# EAGLE design keypadv3 (EAGLE 9.4.2)
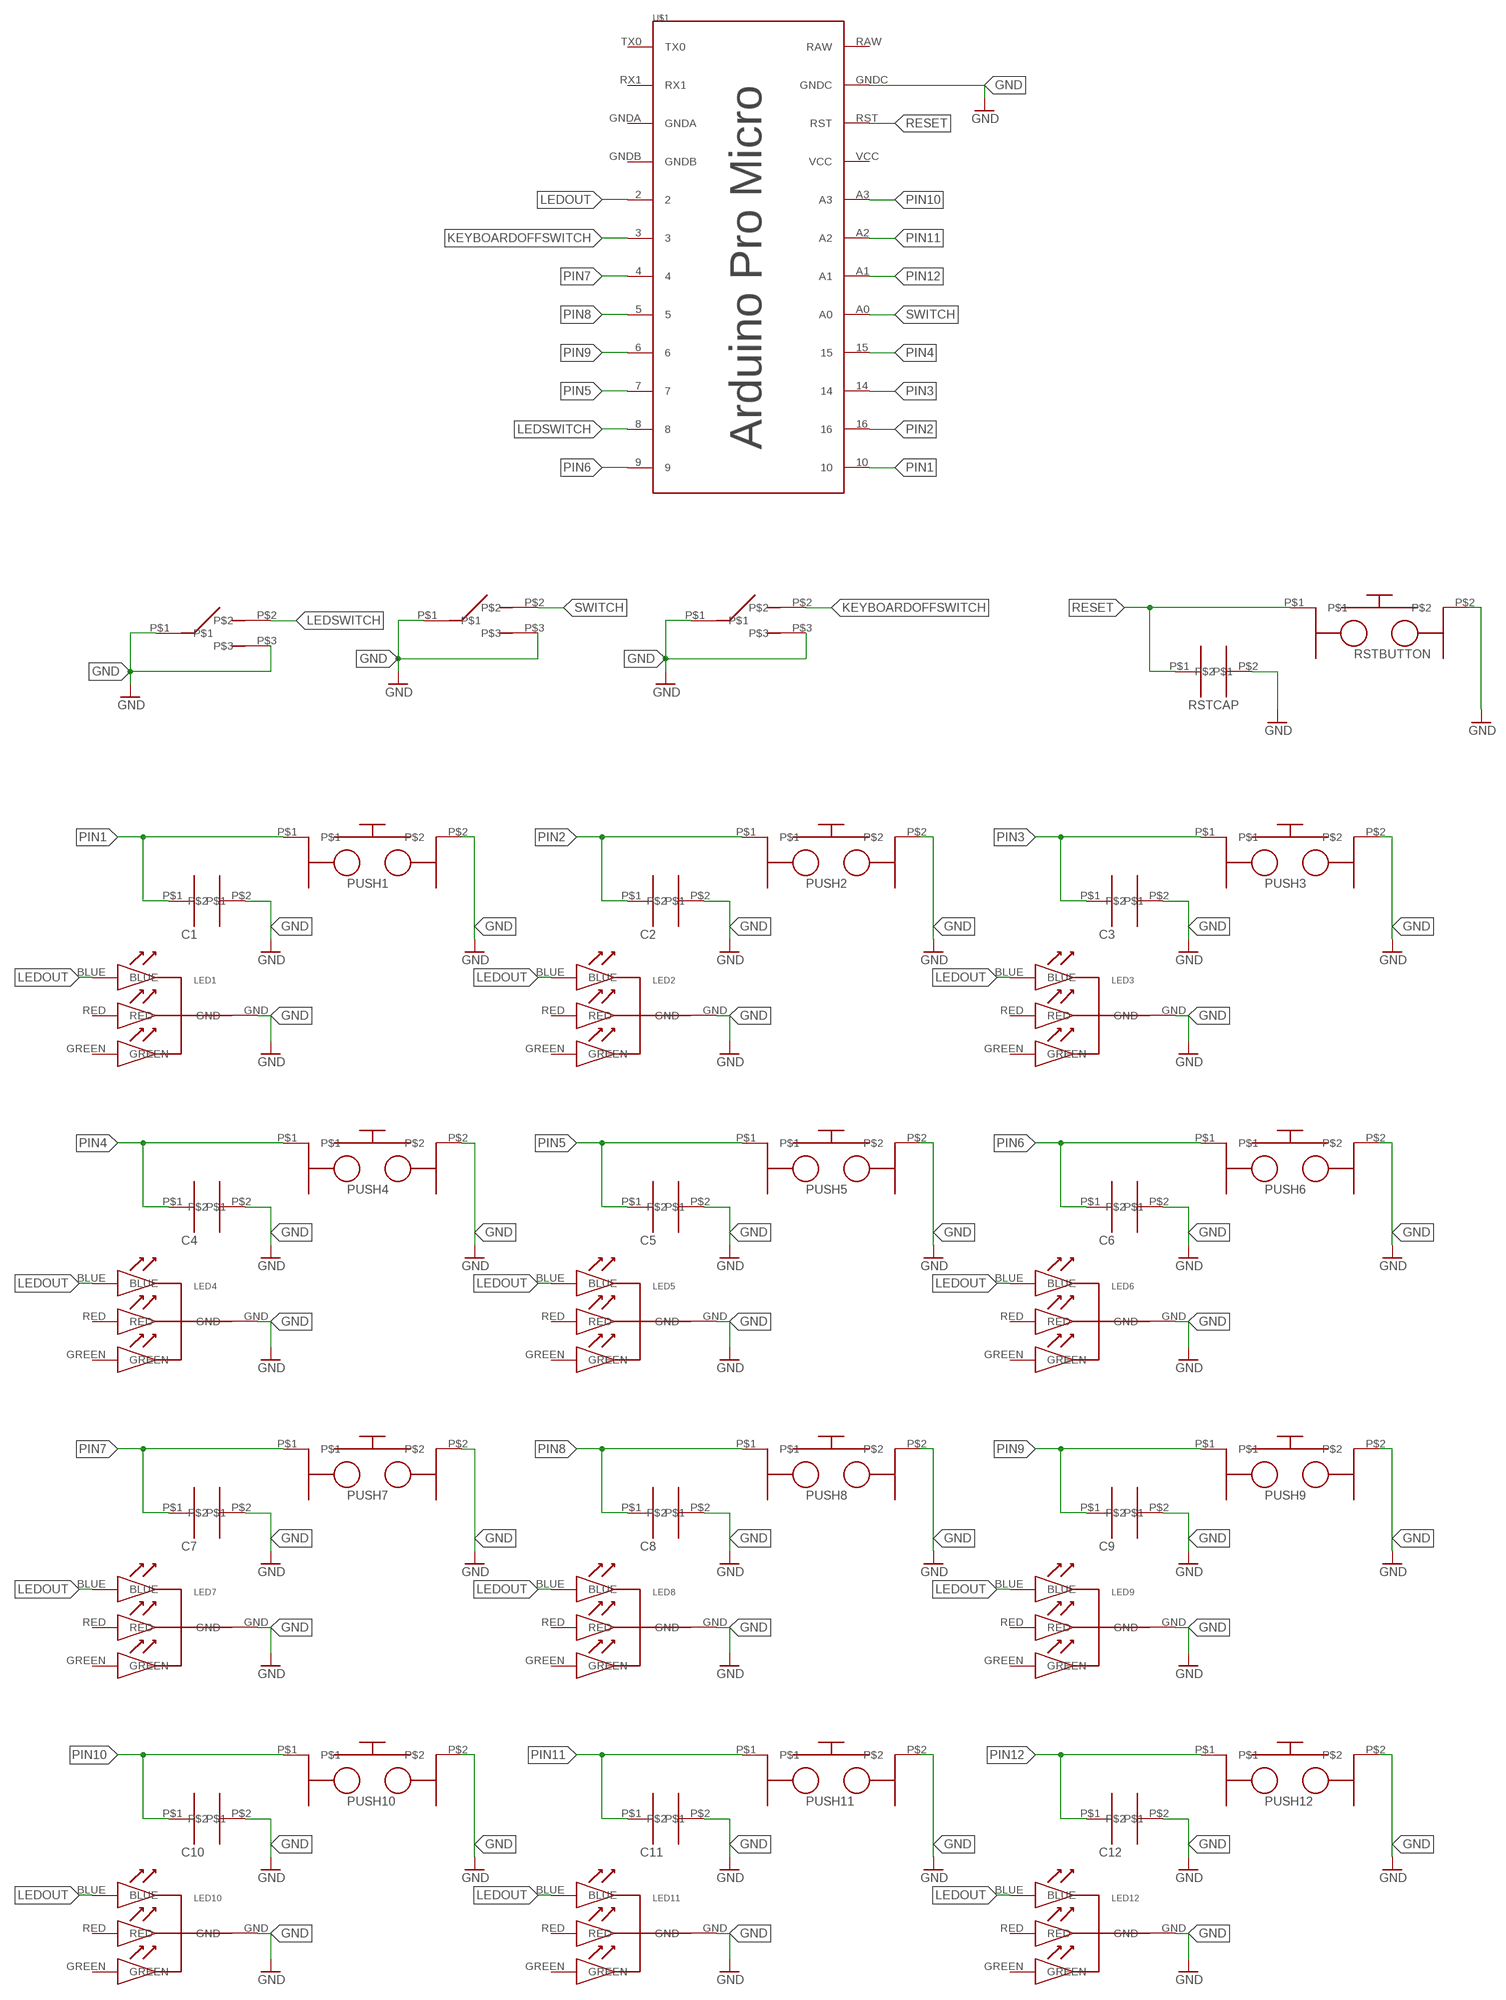
[diagram p0: schematic, sheet 1]

## Parts
C1  CERAMICCAP  [CERAMICCAPACITOR]
C2  CERAMICCAP  [CERAMICCAPACITOR]
C3  CERAMICCAP  [CERAMICCAPACITOR]
C4  CERAMICCAP  [CERAMICCAPACITOR]
C5  CERAMICCAP  [CERAMICCAPACITOR]
C6  CERAMICCAP  [CERAMICCAPACITOR]
C7  CERAMICCAP  [CERAMICCAPACITOR]
C8  CERAMICCAP  [CERAMICCAPACITOR]
C9  CERAMICCAP  [CERAMICCAPACITOR]
C10  CERAMICCAP  [CERAMICCAPACITOR]
C11  CERAMICCAP  [CERAMICCAPACITOR]
C12  CERAMICCAP  [CERAMICCAPACITOR]
LED1  RGBLED5MMCOMMONCATHODE  [LEADSPREAD]
LED2  RGBLED5MMCOMMONCATHODE  [LEADSPREAD]
LED3  RGBLED5MMCOMMONCATHODE  [LEADSPREAD]
LED4  RGBLED5MMCOMMONCATHODE  [LEADSPREAD]
LED5  RGBLED5MMCOMMONCATHODE  [LEADSPREAD]
LED6  RGBLED5MMCOMMONCATHODE  [LEADSPREAD]
LED7  RGBLED5MMCOMMONCATHODE  [LEADSPREAD]
LED8  RGBLED5MMCOMMONCATHODE  [LEADSPREAD]
LED9  RGBLED5MMCOMMONCATHODE  [LEADSPREAD]
LED10  RGBLED5MMCOMMONCATHODE  [LEADSPREAD]
LED11  RGBLED5MMCOMMONCATHODE  [LEADSPREAD]
LED12  RGBLED5MMCOMMONCATHODE  [LEADSPREAD]
PUSH1  2LEADS  [2LEADS]
PUSH2  2LEADS  [2LEADS]
PUSH3  2LEADS  [2LEADS]
PUSH4  2LEADS  [2LEADS]
PUSH5  2LEADS  [2LEADS]
PUSH6  2LEADS  [2LEADS]
PUSH7  2LEADS  [2LEADS]
PUSH8  2LEADS  [2LEADS]
PUSH9  2LEADS  [2LEADS]
PUSH10  2LEADS  [2LEADS]
PUSH11  2LEADS  [2LEADS]
PUSH12  2LEADS  [2LEADS]
RSTBUTTON  2LEADS  [2LEADS]
RSTCAP  CERAMICCAP  [CERAMICCAPACITOR]
SWITCH1  SWITCH  [THREEPINSWITCH]
SWITCH2  SWITCH  [THREEPINSWITCH]
SWITCH3  SWITCH  [THREEPINSWITCH]
U$1  ARDUINOPROMICRO  [ARDUINO_PRO_MICRO]

## Nets
GND: C1.P$2 C2.P$2 C3.P$2 C4.P$2 C5.P$2 C6.P$2 C7.P$2 C8.P$2 C9.P$2 C10.P$2 C11.P$2 C12.P$2 LED1.GND LED2.GND LED3.GND LED4.GND LED5.GND LED6.GND LED7.GND LED8.GND LED9.GND LED10.GND LED11.GND LED12.GND PUSH1.P$2 PUSH2.P$2 PUSH3.P$2 PUSH4.P$2 PUSH5.P$2 PUSH6.P$2 PUSH7.P$2 PUSH8.P$2 PUSH9.P$2 PUSH10.P$2 PUSH11.P$2 PUSH12.P$2 RSTBUTTON.P$2 RSTCAP.P$2 SWITCH1.P$1 SWITCH1.P$3 SWITCH2.P$1 SWITCH2.P$3 SWITCH3.P$1 SWITCH3.P$3 U$1.GNDC
KEYBOARDOFFSWITCH: SWITCH2.P$2 U$1.3
LEDOUT: LED1.BLUE LED2.BLUE LED3.BLUE LED4.BLUE LED5.BLUE LED6.BLUE LED7.BLUE LED8.BLUE LED9.BLUE LED10.BLUE LED11.BLUE LED12.BLUE U$1.2
LEDSWITCH: SWITCH1.P$2 U$1.8
PIN1: C1.P$1 PUSH1.P$1 U$1.10
PIN2: C2.P$1 PUSH2.P$1 U$1.16
PIN3: C3.P$1 PUSH3.P$1 U$1.14
PIN4: C4.P$1 PUSH4.P$1 U$1.15
PIN5: C5.P$1 PUSH5.P$1 U$1.7
PIN6: C6.P$1 PUSH6.P$1 U$1.9
PIN7: C7.P$1 PUSH7.P$1 U$1.4
PIN8: C8.P$1 PUSH8.P$1 U$1.5
PIN9: C9.P$1 PUSH9.P$1 U$1.6
PIN10: C10.P$1 PUSH10.P$1 U$1.A3
PIN11: C11.P$1 PUSH11.P$1 U$1.A2
PIN12: C12.P$1 PUSH12.P$1 U$1.A1
RESET: RSTBUTTON.P$1 RSTCAP.P$1 U$1.RST
SWITCH: SWITCH3.P$2 U$1.A0
Unconnected: LED1.GREEN LED1.RED LED2.GREEN LED2.RED LED3.GREEN LED3.RED LED4.GREEN LED4.RED LED5.GREEN LED5.RED LED6.GREEN LED6.RED LED7.GREEN LED7.RED LED8.GREEN LED8.RED LED9.GREEN LED9.RED LED10.GREEN LED10.RED LED11.GREEN LED11.RED LED12.GREEN LED12.RED U$1.GNDA U$1.GNDB U$1.RAW U$1.RX1 U$1.TX0 U$1.VCC

## Library data of the parts
C1-C12 RSTCAP = capacitors:CERAMICCAP
LED1-LED12 = customLEDS:RGBLED5MMCOMMONCATHODE
PUSH1-PUSH12 RSTBUTTON = pushbutton:2LEADS
SWITCH1-SWITCH3 = Switch:SWITCH
U$1 = arduino_pro_micro:ARDUINOPROMICRO

## Board
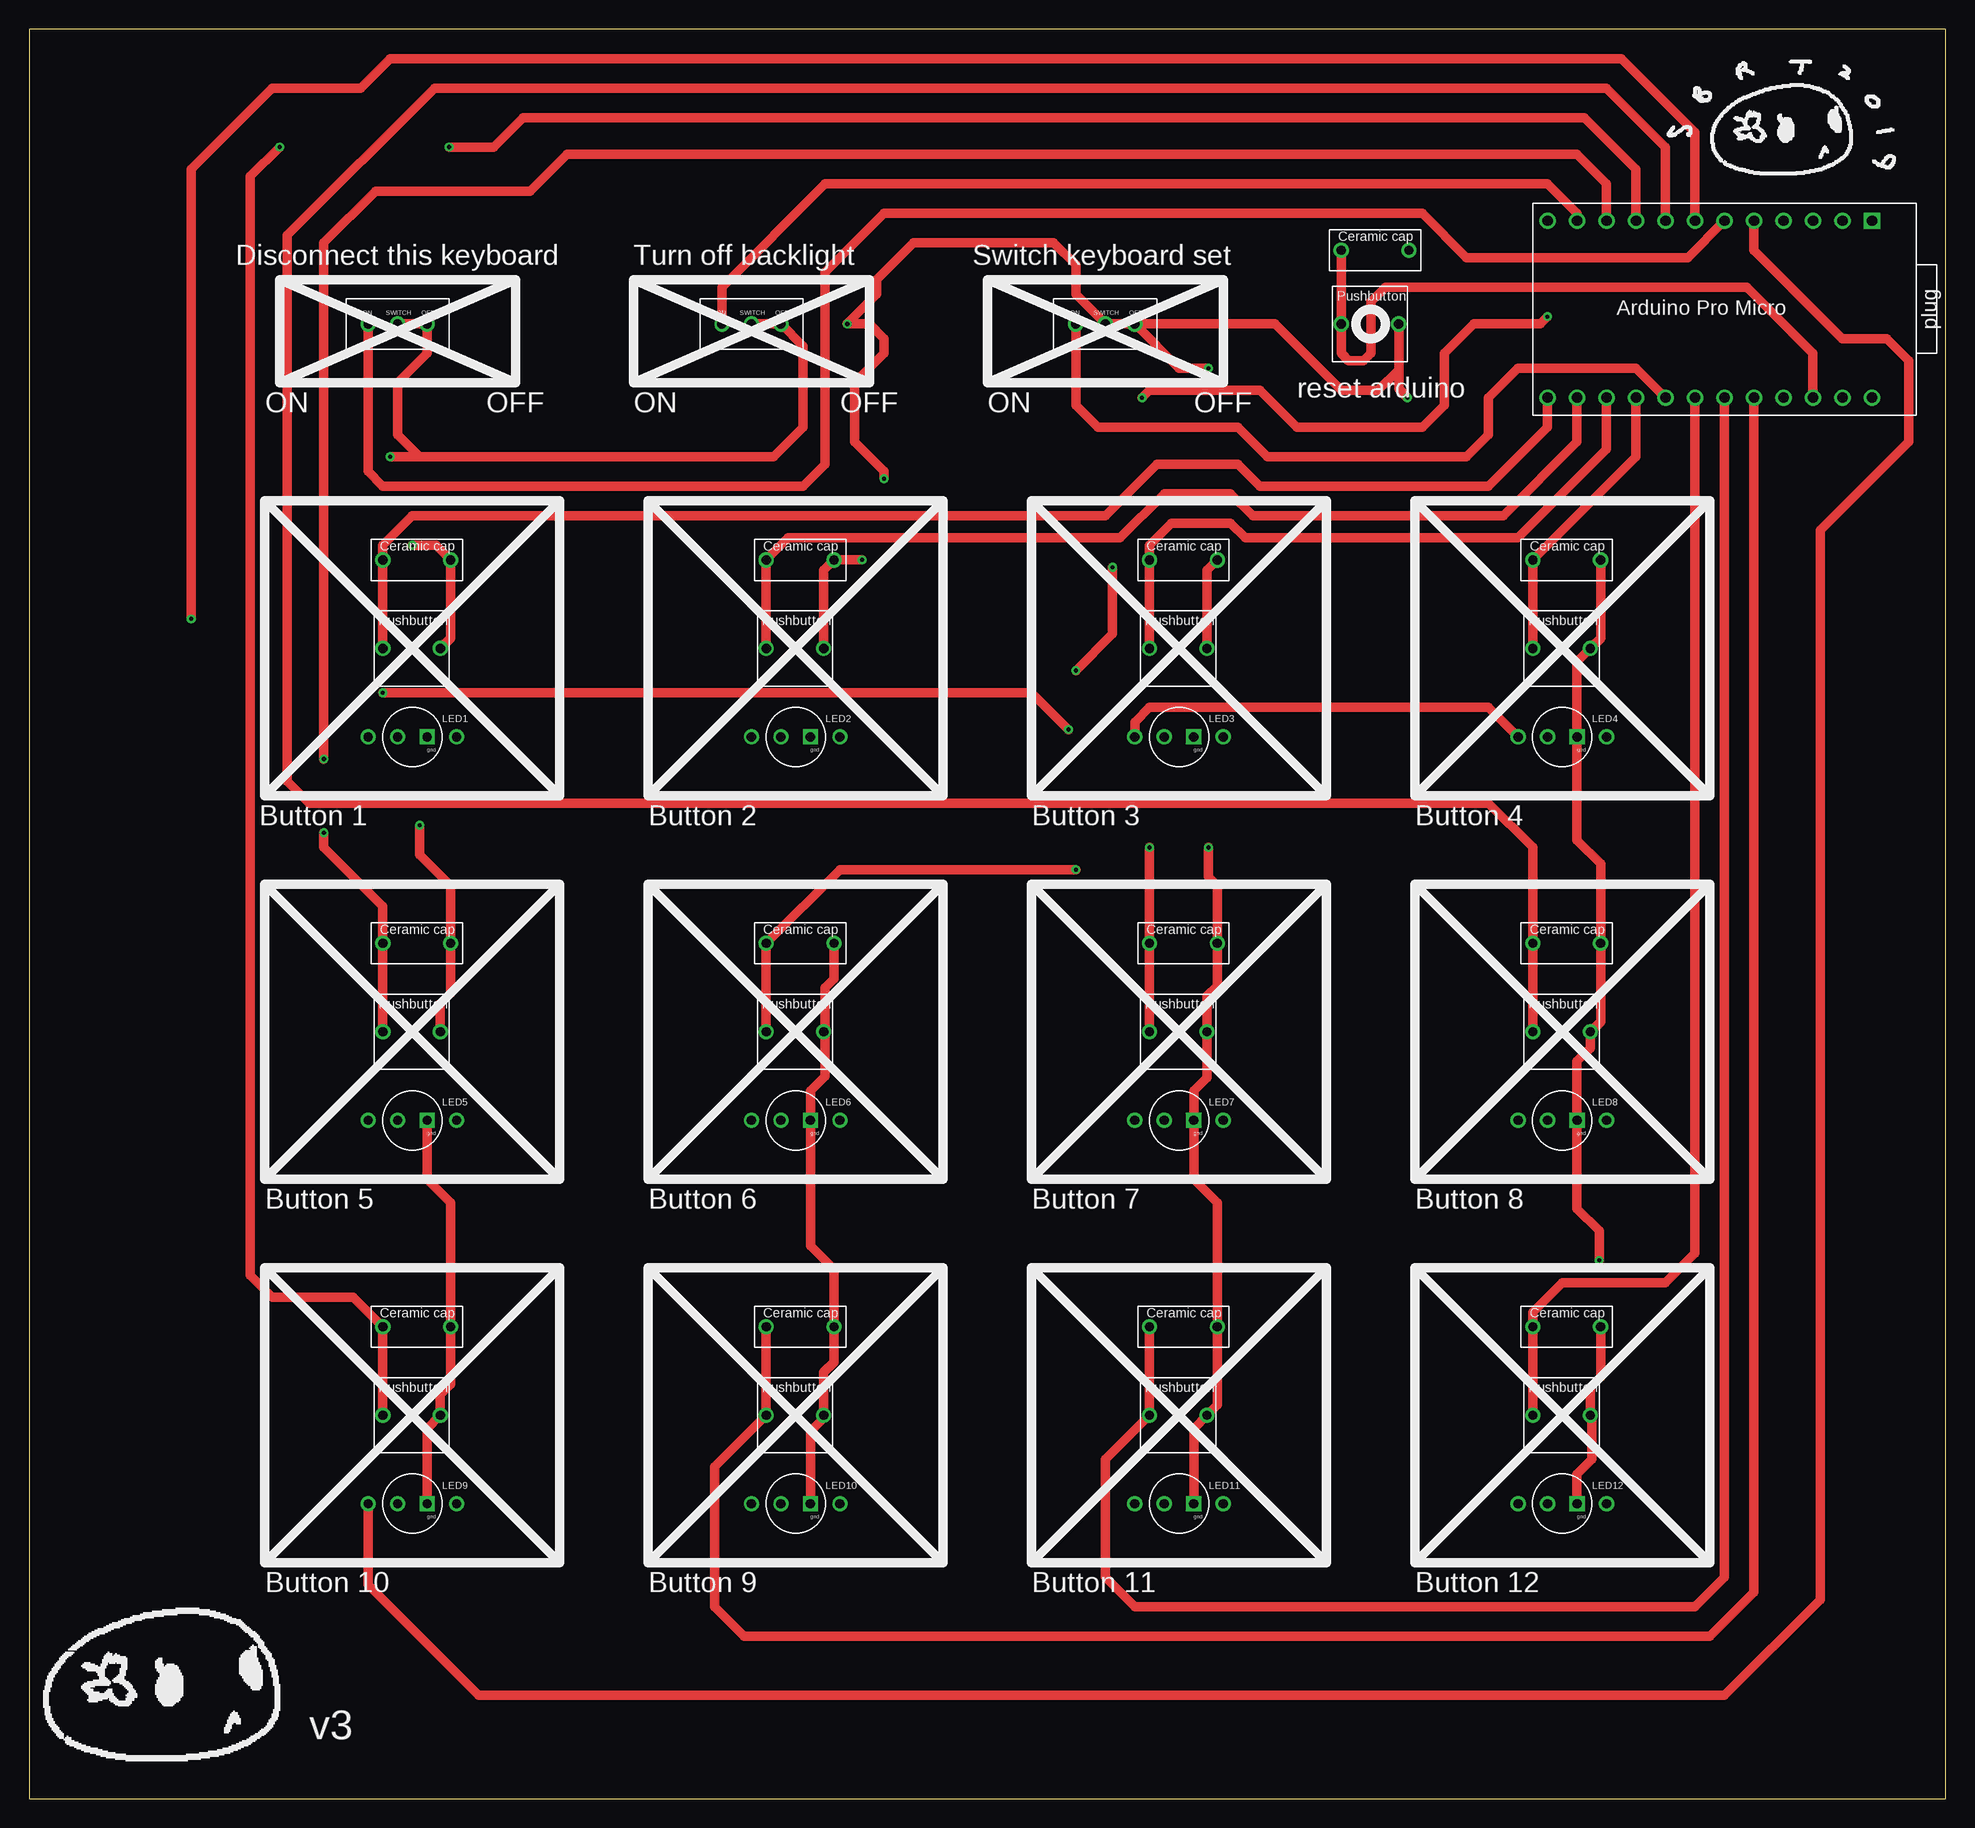
[diagram p1: board, top side]
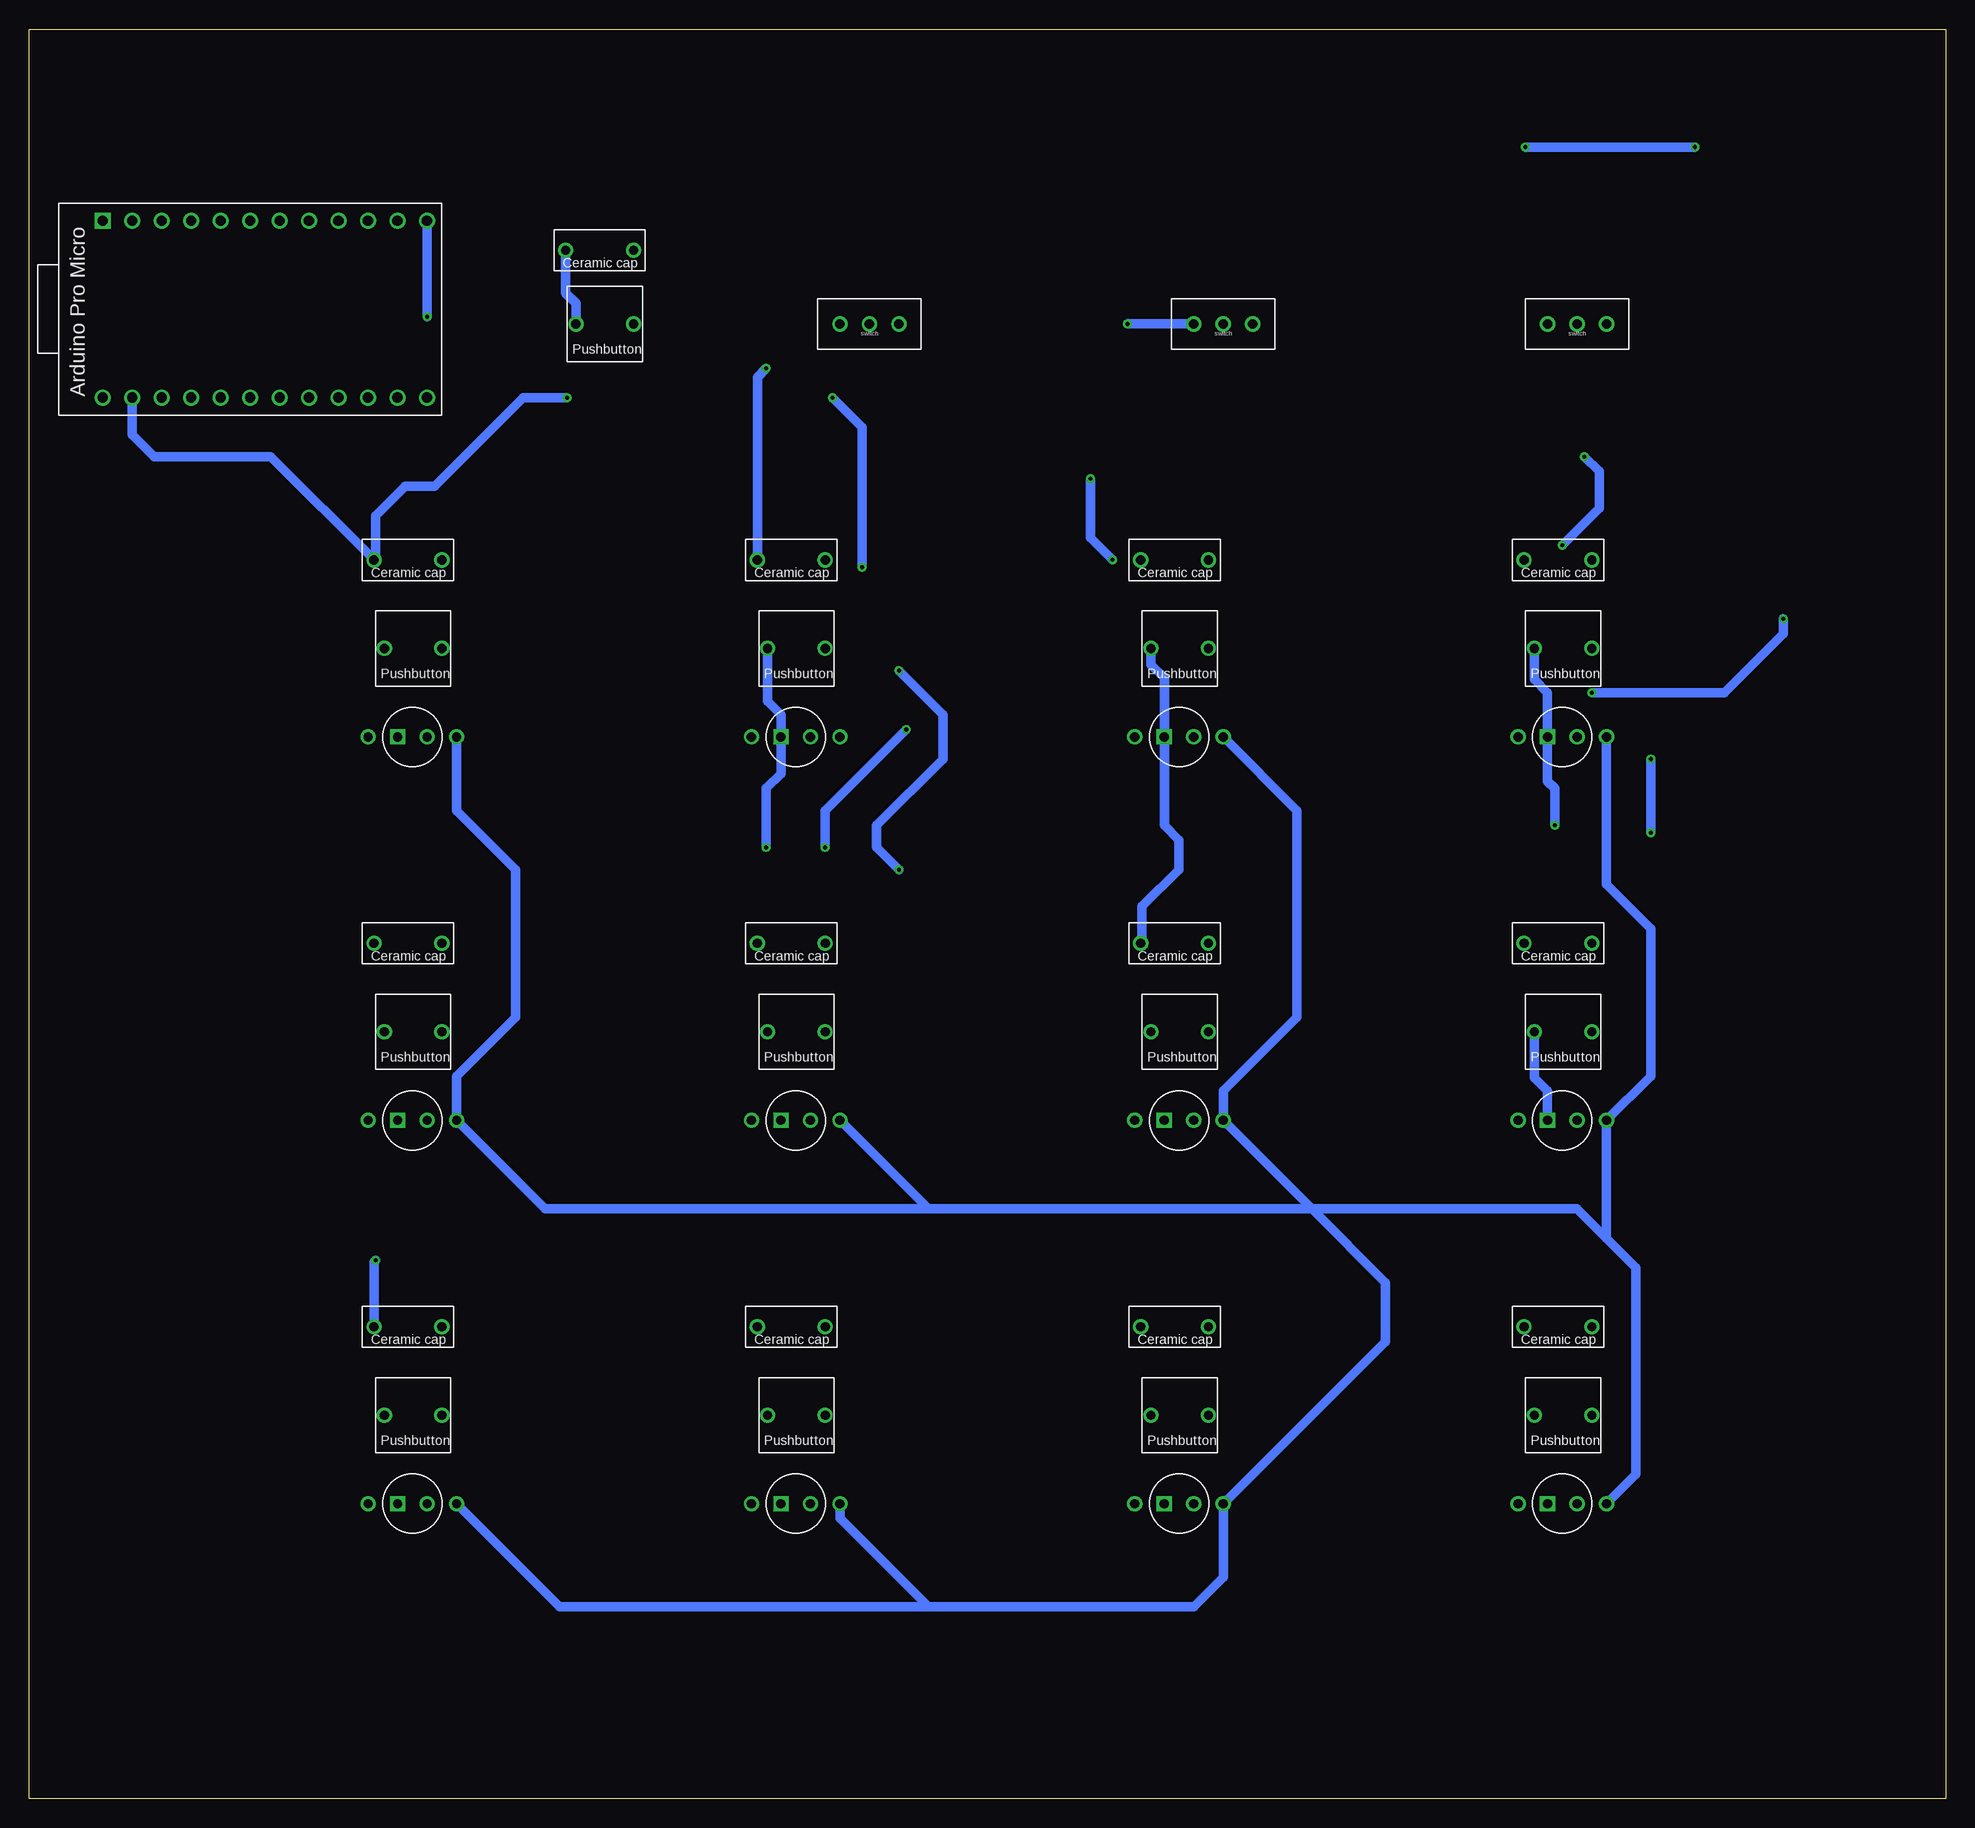
[diagram p2: board, bottom side, seen from below]

Size 165.1 x 152.4 mm. Coordinates in mm from the lower left corner, seen from the top.
Outline: 0,0 165.1,0 165.1,152.4 0,152.4 0,0
Copper layers (1*16): Top 0.035mm / dielectric 1.5mm / Bottom 0.035mm
Design rules "default": minimum track width 6mil, minimum drill 0.35mm, track to track 6mil, track to pad 6mil, pad to pad 6mil, via to via 6mil, smd to smd 6mil, copper to edge 40mil, drill to drill 6mil, minimum pad ring 10mil, minimum via ring 8mil, stop-mask expansion 4mil, vias tented up to drill 0mil, thermal gap 10mil

### Footprints (pad centres in the part's own frame; a part is rotated, then mirrored left to right if it is on the bottom)
CERAMICCAPACITOR = drill 0.8: P$1 0,0; P$2 5.842,0
LEADSPREAD = drill 0.8: BLUE -3.81,0; GREEN -1.27,0; RED 3.81,0 | drill 0.8 square: GND 1.27,0
2LEADS = drill 0.8: P$1 0,0; P$2 4.953,0
THREEPINSWITCH = drill 0.8: P$1 2.54,0; P$2 0,0; P$3 5.08,0
ARDUINO_PRO_MICRO = drill 0.9: 2 0,-10.16; 3 0,-12.7; 4 0,-15.24; 5 0,-17.78; 6 0,-20.32; 7 0,-22.86; 8 0,-25.4; 9 0,-27.94; 10 15.24,-27.94; 14 15.24,-22.86; 15 15.24,-20.32; 16 15.24,-25.4; A0 15.24,-17.78; A1 15.24,-15.24; A2 15.24,-12.7; A3 15.24,-10.16; GNDA 0,-5.08; GNDB 0,-7.62; GNDC 15.24,-2.54; RAW 15.24,0; RST 15.24,-5.08; RX1 0,-2.54; VCC 15.24,-7.62 | drill 0.9 square: TX0 0,0

### Placement (x,y rotation side)
C1  30.48,106.68 0 top
C2  63.5,106.68 0 top
C3  96.52,106.68 0 top
C4  129.54,106.68 0 top
C5  30.48,73.66 0 top
C6  63.5,73.66 0 top
C7  96.52,73.66 0 top
C8  129.54,73.66 0 top
C9  30.48,40.64 0 top
C10  63.5,40.64 0 top
C11  96.52,40.64 0 top
C12  129.54,40.64 0 top
LED1  33.02,91.44 0 top
LED2  66.04,91.44 0 top
LED3  99.06,91.44 0 top
LED4  132.08,91.44 0 top
LED5  33.02,58.42 0 top
LED6  66.04,58.42 0 top
LED7  99.06,58.42 0 top
LED8  132.08,58.42 0 top
LED9  33.02,25.4 0 top
LED10  66.04,25.4 0 top
LED11  99.06,25.4 0 top
LED12  132.08,25.4 0 top
PUSH1  30.48,99.06 0 top
PUSH2  63.5,99.06 0 top
PUSH3  96.52,99.06 0 top
PUSH4  129.54,99.06 0 top
PUSH5  30.48,66.04 0 top
PUSH6  63.5,66.04 0 top
PUSH7  96.52,66.04 0 top
PUSH8  129.54,66.04 0 top
PUSH9  30.48,33.02 0 top
PUSH10  63.5,33.02 0 top
PUSH11  96.52,33.02 0 top
PUSH12  129.54,33.02 0 top
RSTBUTTON  113.03,127 0 top
RSTCAP  113.03,133.35 0 top
SWITCH1  59.69,127 0 top
SWITCH2  29.21,127 0 top
SWITCH3  90.17,127 0 top
U$1  158.75,135.89 270 top

### Tracks (layer width: path | path; a pad name or v marks a point on that pad's centre or on a via)
GND  (via drill 0.35)
  Top 0.813: SWITCH2.P$1 SWITCH2.P$3 34.29,124.46 31.75,121.92 31.75,117.47 33.66,115.57 | SWITCH1.P$1 SWITCH1.P$3 66.67,125.09 66.67,118.11 64.14,115.57 33.66,115.57 | SWITCH3.P$3 SWITCH3.P$1 90.17,129.54 90.17,132.08 88.27,133.99 76.2,133.99 73.03,130.81 73.03,129.54 v70.48,127 72.39,127 73.66,125.73 73.66,124.46 71.12,121.92 71.12,116.84 73.66,114.3 v73.66,113.67 | SWITCH3.P$3 107.31,127 113.03,121.28 116.2,121.28 117.98,123.06 | RSTBUTTON.P$2 117.98,123.06 | 33.66,115.57 v31.11,115.57 | v33.02,107.95 35.05,107.95 C1.P$2 36.32,99.95 PUSH1.P$2 | v71.75,106.68 C2.P$2 68.45,105.79 PUSH2.P$2 | v101.6,123.19 99.06,123.19 SWITCH3.P$3 | C3.P$2 101.47,105.79 PUSH3.P$2 | v33.66,83.82 33.66,81.28 36.32,78.61 C5.P$2 36.32,69.34 35.43,68.45 PUSH5.P$2 | C6.P$2 69.34,70.61 68.58,69.85 68.58,66.17 | PUSH6.P$2 68.58,66.17 | v101.6,81.92 101.6,79.38 102.36,78.61 C7.P$2 102.36,69.98 101.47,69.09 PUSH7.P$2 101.47,62.1 100.33,60.96 LED7.GND 100.33,53.34 102.36,51.31 C11.P$2 102.36,33.91 PUSH11.P$2 100.33,31.88 LED11.GND | C12.P$2 135.38,36.32 134.49,35.43 PUSH12.P$2 134.62,32.89 134.62,29.21 133.35,27.94 LED12.GND | v135.25,46.35 135.25,48.9 133.35,50.8 LED8.GND 133.35,63.5 134.49,64.64 PUSH8.P$2 135.38,66.93 C8.P$2 135.38,80.52 133.35,82.55 LED4.GND 133.35,97.92 PUSH4.P$2 135.38,99.95 C4.P$2 | 117.98,123.06 117.98,121.41 v118.75,120.65 | LED5.GND 34.29,53.34 36.32,51.31 C9.P$2 36.32,35.69 35.43,34.8 PUSH9.P$2 34.29,31.88 LED9.GND | 68.58,66.17 68.58,62.23 67.31,60.96 LED6.GND 67.31,47.62 69.34,45.59 C10.P$2 69.34,37.59 68.45,36.7 PUSH10.P$2 68.58,32.89 67.31,31.62 LED10.GND
  Bottom 0.813: RSTCAP.P$2 118.87,129.67 117.98,128.78 RSTBUTTON.P$2 | SWITCH1.P$3 v70.48,127 | v31.11,115.57 29.84,114.3 29.84,111.12 v33.02,107.95 | v71.75,106.68 73.66,108.58 v73.66,113.67 | C3.P$2 102.36,122.43 v101.6,123.19 | C6.P$2 69.22,73.79 69.22,76.83 66.04,80.01 66.04,82.55 67.31,83.82 LED2.GND 67.31,96.52 68.45,97.66 PUSH2.P$2 | PUSH3.P$2 101.47,94.49 100.33,93.34 LED3.GND 100.33,88.27 101.6,87 v101.6,81.92 | C12.P$2 135.38,46.23 v135.25,46.35 | U$1.GNDC 156.21,117.47 154.31,115.57 144.27,115.57 C4.P$2 135.25,106.81 135.25,110.49 132.72,113.03 130.18,113.03 122.56,120.65 v118.75,120.65 | PUSH1.P$2 35.43,96.39 34.29,95.25 LED1.GND 34.29,87.63 33.66,87 v33.66,83.82 | LED5.GND 34.29,60.96 35.43,62.1 PUSH5.P$2
KEYBOARDOFFSWITCH
  Top 0.813: U$1.3 142.88,132.72 123.83,132.72 120.02,136.53 73.66,136.53 68.58,131.44 68.58,114.94 66.67,113.03 30.48,113.03 29.21,114.3 SWITCH2.P$2
LEDOUT
  Top 0.813: U$1.2 148.59,133.35 156.21,125.73 160.02,125.73 161.93,123.83 161.93,116.84 154.31,109.22 154.31,17.14 146.05,8.89 38.73,8.89 29.21,18.41 LED9.BLUE | LED3.BLUE 95.25,92.71 96.52,93.98 125.73,93.98 LED4.BLUE
  Bottom 0.813: LED1.BLUE 29.21,78.74 25.4,74.93 25.4,62.23 LED5.BLUE 29.21,48.26 | 29.21,48.26 26.67,45.72 26.67,27.94 LED9.BLUE | 29.21,48.26 31.75,50.8 54.61,50.8 | 54.61,50.8 LED6.BLUE 62.23,60.96 55.88,67.31 55.88,85.09 LED2.BLUE | 54.61,50.8 48.26,44.45 48.26,39.37 LED10.BLUE 62.23,19.05 64.77,16.51 87.63,16.51 | 54.61,50.8 87.63,50.8 | LED7.BLUE 87.63,50.8 | 87.63,16.51 95.25,24.13 LED11.BLUE | 87.63,16.51 119.38,16.51 LED12.BLUE | 87.63,50.8 120.65,50.8 LED8.BLUE 128.27,62.23 123.19,67.31 123.19,80.01 128.27,85.09 LED4.BLUE
LEDSWITCH
  Top 0.813: U$1.8 133.35,136.53 130.81,139.06 68.58,139.06 59.69,130.18 SWITCH1.P$2
PIN1
  Top 0.813: PUSH1.P$1 C1.P$1 30.48,107.95 33.02,110.49 92.71,110.49 97.16,114.94 104.14,114.94 106.05,113.03 125.73,113.03 130.81,118.11 U$1.10
PIN2
  Top 0.813: PUSH2.P$1 C2.P$1 65.41,108.58 93.98,108.58 97.79,112.39 103.5,112.39 105.41,110.49 127,110.49 133.35,116.84 U$1.16
PIN3
  Top 0.813: PUSH3.P$1 C3.P$1 96.52,107.95 98.42,109.86 103.5,109.86 104.78,108.58 128.27,108.58 135.89,116.2 U$1.14
PIN4
  Top 0.813: PUSH4.P$1 C4.P$1 138.43,115.57 U$1.15
PIN5  (via drill 0.35)
  Top 0.813: PUSH5.P$1 C5.P$1 30.48,76.83 25.4,81.92 v25.4,83.19 | U$1.7 135.89,139.06 133.35,141.6 46.35,141.6 43.18,138.43 29.84,138.43 25.4,133.99 v25.4,89.53
  Bottom 0.813: v25.4,89.53 v25.4,83.19
PIN6  (via drill 0.35)
  Top 0.813: PUSH6.P$1 C6.P$1 69.85,80.01 v90.17,80.01 | v95.89,120.65 96.52,121.28 106.05,121.28 109.22,118.11 120.02,118.11 121.92,120.02 121.92,124.46 124.46,127 130.18,127 v130.81,127.64 | v90.17,97.16 93.34,100.33 v93.34,106.05
  Bottom 0.813: v90.17,80.01 92.08,81.92 92.08,83.82 86.36,89.53 86.36,93.34 v90.17,97.16 | v93.34,106.05 93.34,118.11 v95.89,120.65 | v130.81,127.64 U$1.9
PIN7  (via drill 0.35)
  Top 0.813: PUSH7.P$1 C7.P$1 v96.52,81.92 | U$1.4 143.51,143.51 137.16,149.86 31.11,149.86 28.57,147.32 20.95,147.32 13.97,140.34 v13.97,101.6 | v30.48,95.25 86.36,95.25 v89.53,92.08
  Bottom 0.813: v89.53,92.08 96.52,85.09 v96.52,81.92 | v30.48,95.25 19.05,95.25 13.97,100.33 v13.97,101.6
PIN8
  Top 0.813: PUSH8.P$1 C8.P$1 129.54,81.92 125.73,85.72 24.13,85.72 22.23,87.63 22.23,134.62 34.92,147.32 135.89,147.32 140.97,142.24 U$1.5
PIN9  (via drill 0.35)
  Top 0.813: PUSH9.P$1 C9.P$1 27.94,43.18 20.95,43.18 19.05,45.09 19.05,139.7 v21.59,142.24 | v36.2,142.24 40.01,142.24 42.55,144.78 133.99,144.78 138.43,140.34 U$1.6
  Bottom 0.813: v36.2,142.24 v21.59,142.24
PIN10
  Top 0.813: C10.P$1 PUSH10.P$1 59.05,28.57 59.05,16.51 61.59,13.97 144.78,13.97 148.59,17.78 U$1.A3
PIN11
  Top 0.813: C11.P$1 PUSH11.P$1 92.71,29.21 92.71,19.05 95.25,16.51 143.51,16.51 146.05,19.05 U$1.A2
PIN12
  Top 0.813: PUSH12.P$1 C12.P$1 129.54,41.91 132.08,44.45 140.97,44.45 143.51,46.99 U$1.A1
RESET
  Top 0.813: RSTCAP.P$1 RSTBUTTON.P$1 113.03,124.46 113.67,123.83 114.94,123.83 115.57,124.46 115.57,128.91 116.84,130.18 147.96,130.18 153.67,124.46 U$1.RST
SWITCH
  Top 0.813: U$1.A0 138.43,123.19 128.27,123.19 125.73,120.65 125.73,117.47 123.83,115.57 106.68,115.57 104.14,118.11 92.08,118.11 90.17,120.02 SWITCH3.P$2

### Text on the board
tPlace: Disconnect this keyboard | Turn off backlight | Switch keyboard set | reset arduino | ON | OFF | ON | OFF | ON | OFF | Button 1 | Button 2 | Button 3 | Button 4 | Button 5 | Button 6 | Button 7 | Button 8 | Button 10 | Button 9 | Button 11 | Button 12 | v3